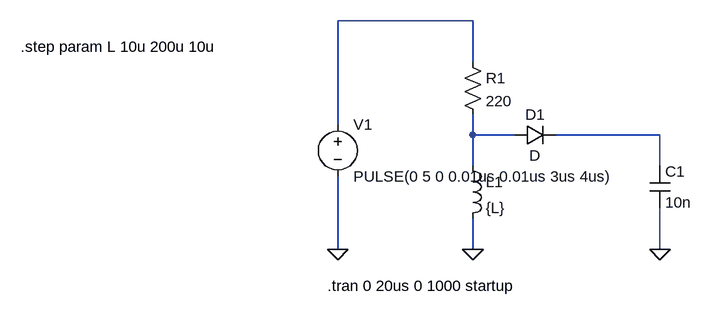
[diagram p0: schematic metal_detector.asc]
metal_detector.asc, the LTspice schematic file:
Version 4
SHEET 1 880 680
WIRE 176 -128 -32 -128
WIRE 176 -64 176 -128
WIRE -32 32 -32 -128
WIRE 176 48 176 16
WIRE 240 48 176 48
WIRE 464 48 304 48
WIRE 176 96 176 48
WIRE 464 96 464 48
WIRE -32 224 -32 112
WIRE 176 224 176 176
WIRE 464 224 464 160
FLAG 176 224 0
FLAG -32 224 0
FLAG 464 224 0
DATAFLAG 176 48 ""
SYMBOL ind 160 80 R0
SYMATTR InstName L1
SYMATTR Value {L}
SYMATTR SpiceLine Rser=0.5
SYMBOL res 160 -80 R0
SYMATTR InstName R1
SYMATTR Value 220
SYMBOL voltage -32 16 R0
WINDOW 123 0 0 Left 2
WINDOW 39 0 0 Left 2
SYMATTR InstName V1
SYMATTR Value PULSE(0 5 0 0.01us 0.01us 3us 4us)
SYMBOL diode 240 64 R270
WINDOW 0 32 32 VTop 2
WINDOW 3 0 32 VBottom 2
SYMATTR InstName D1
SYMBOL cap 448 96 R0
SYMATTR InstName C1
SYMATTR Value 10n
TEXT -48 280 Left 2 !.tran 0 20us 0 1000 startup
TEXT -520 -88 Left 2 !.step param L 10u 200u 10u

The netlist it stands for:
* metal_detector.asc
L1 N002 0 {L} Rser=0.5
R1 N001 N002 220
V1 N001 0 PULSE(0 5 0 0.01us 0.01us 3us 4us)
D1 N002 N003 D
C1 N003 0 10n
.model D D
.lib standard.dio
.tran 0 20us 0 1000 startup
.step param L 10u 200u 10u
.backanno
.end